# Altium schematic sheet FPGAPower.SchDoc: HPBI Controller
size B; ApprovedBy: J Johnson; CheckedBy: J Johnson; Author: sdfasdfdfAEFfasdFfaF; DrawnBy: J Johnson; Organization: Opsero Electronic Design; Address1: 21-915 Av. Marguerite-Bourgeoys; Address2: Québec (QC); Address3: G1S 3X4; DocumentNumber: OP009-001-SCH; Revision: 1.0; SheetNumber: 12; SheetTotal: 16; Tel1: (581) 308-8830; Tel2: (581) 308-8830; Project: HPBI Controller; CheckedDate: 2013-12-13; Sheet: Zynq Power Supplies; PageSetup: Record=PageOptions|CenterHorizontal=True|CenterVertical=True|PrintScale=1.08|XCorrection=1.00|YCorrection=1.00|PrintKind=0|BorderSize=5000000|LeftOffset=0|BottomOffset=0|Orientation=2|PaperLength=1000|PaperWidth=1000|Scale=100|PaperSource=7|PrintQuality=-4|MediaType=1|DitherType=10|PaperKind=Tabloid     [11 x 17 in]|PrintScaleMode=1; DrawDate: 2013-12-13; SchTitle: HPBI Controller; RevDescription: Preliminary; RevDate: 2014-01-29; RevBy: J Johnson
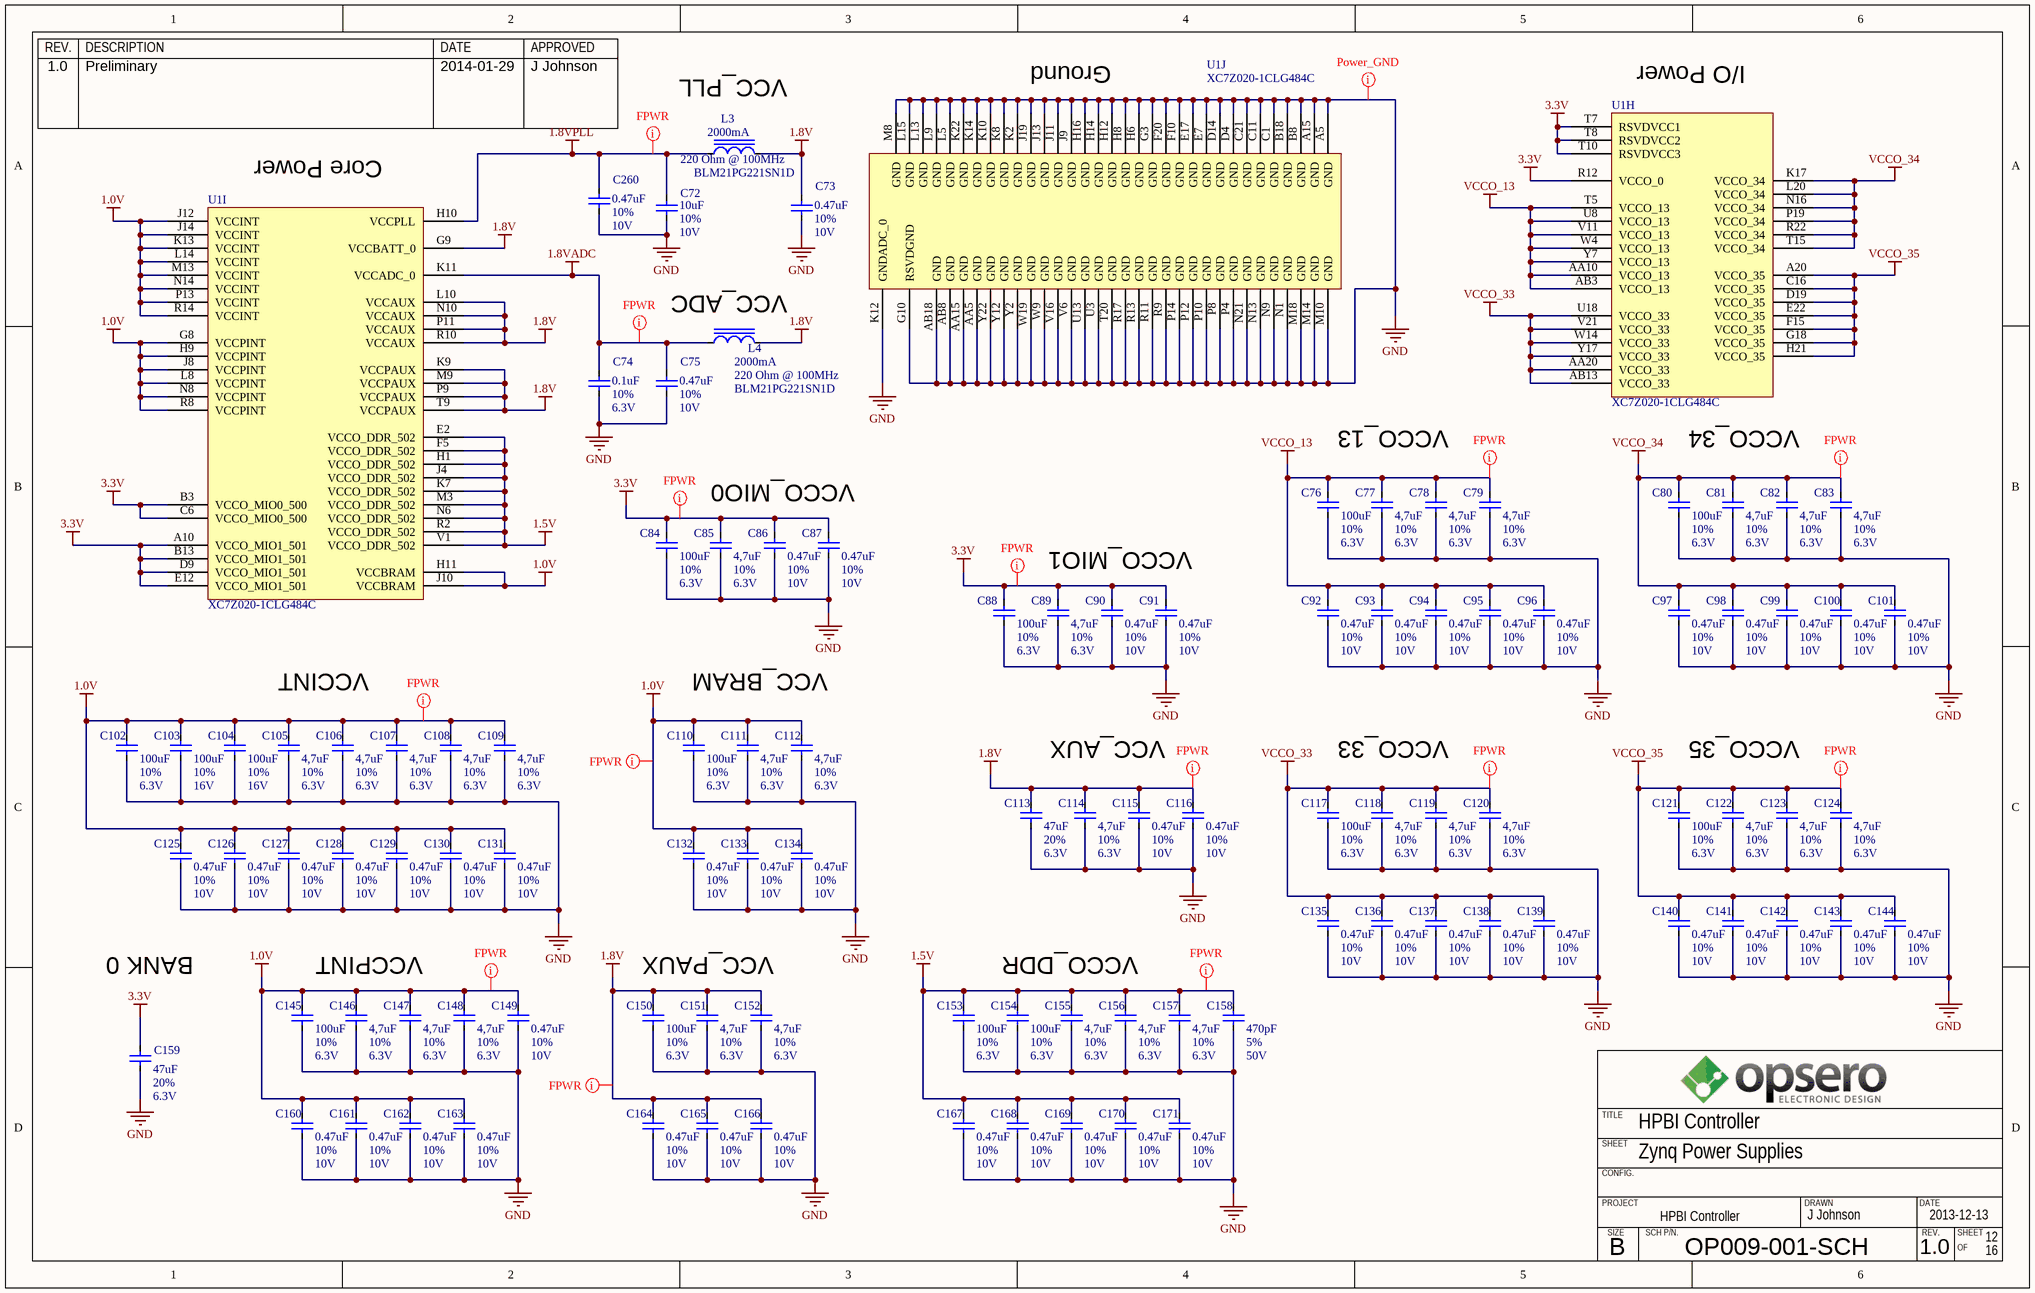
[diagram p0: FPGAPower.SchDoc]

## Parts
C72  value 10uF  Tolerance: 10%  Voltage: 10V  [CAPC1608X38N]  (hidden comment: CAPACITOR_NP_TYPE1)
C73  value 0.47uF  Tolerance: 10%  Voltage: 10V  [CAPC1005X55N]  (hidden comment: CAPACITOR_NP_TYPE1)
C74  value 0.1uF  Tolerance: 10%  Voltage: 6.3V  [CAPC0603X33N]  (hidden comment: CAPACITOR_NP_TYPE1)
C75  value 0.47uF  Tolerance: 10%  Voltage: 10V  [CAPC1005X55N]  (hidden comment: CAPACITOR_NP_TYPE1)
C76  value 100uF  Tolerance: 10%  Voltage: 6.3V  [CAPC3225X250N]  (hidden comment: CAPACITOR_NP_TYPE1)
C77  value 4,7uF  Tolerance: 10%  Voltage: 6.3V  [CAPC1005X33N]  (hidden comment: CAPACITOR_NP_TYPE1)
C78  value 4,7uF  Tolerance: 10%  Voltage: 6.3V  [CAPC1005X33N]  (hidden comment: CAPACITOR_NP_TYPE1)
C79  value 4,7uF  Tolerance: 10%  Voltage: 6.3V  [CAPC1005X33N]  (hidden comment: CAPACITOR_NP_TYPE1)
C80  value 100uF  Tolerance: 10%  Voltage: 6.3V  [CAPC3225X250N]  (hidden comment: CAPACITOR_NP_TYPE1)
C81  value 4,7uF  Tolerance: 10%  Voltage: 6.3V  [CAPC1005X33N]  (hidden comment: CAPACITOR_NP_TYPE1)
C82  value 4,7uF  Tolerance: 10%  Voltage: 6.3V  [CAPC1005X33N]  (hidden comment: CAPACITOR_NP_TYPE1)
C83  value 4,7uF  Tolerance: 10%  Voltage: 6.3V  [CAPC1005X33N]  (hidden comment: CAPACITOR_NP_TYPE1)
C84  value 100uF  Tolerance: 10%  Voltage: 6.3V  [CAPC3225X250N]  (hidden comment: CAPACITOR_NP_TYPE1)
C85  value 4,7uF  Tolerance: 10%  Voltage: 6.3V  [CAPC1005X33N]  (hidden comment: CAPACITOR_NP_TYPE1)
C86  value 0.47uF  Tolerance: 10%  Voltage: 10V  [CAPC1005X55N]  (hidden comment: CAPACITOR_NP_TYPE1)
C87  value 0.47uF  Tolerance: 10%  Voltage: 10V  [CAPC1005X55N]  (hidden comment: CAPACITOR_NP_TYPE1)
C88  value 100uF  Tolerance: 10%  Voltage: 6.3V  [CAPC3225X250N]  (hidden comment: CAPACITOR_NP_TYPE1)
C89  value 4,7uF  Tolerance: 10%  Voltage: 6.3V  [CAPC1005X33N]  (hidden comment: CAPACITOR_NP_TYPE1)
C90  value 0.47uF  Tolerance: 10%  Voltage: 10V  [CAPC1005X55N]  (hidden comment: CAPACITOR_NP_TYPE1)
C91  value 0.47uF  Tolerance: 10%  Voltage: 10V  [CAPC1005X55N]  (hidden comment: CAPACITOR_NP_TYPE1)
C92  value 0.47uF  Tolerance: 10%  Voltage: 10V  [CAPC1005X55N]  (hidden comment: CAPACITOR_NP_TYPE1)
C93  value 0.47uF  Tolerance: 10%  Voltage: 10V  [CAPC1005X55N]  (hidden comment: CAPACITOR_NP_TYPE1)
C94  value 0.47uF  Tolerance: 10%  Voltage: 10V  [CAPC1005X55N]  (hidden comment: CAPACITOR_NP_TYPE1)
C95  value 0.47uF  Tolerance: 10%  Voltage: 10V  [CAPC1005X55N]  (hidden comment: CAPACITOR_NP_TYPE1)
C96  value 0.47uF  Tolerance: 10%  Voltage: 10V  [CAPC1005X55N]  (hidden comment: CAPACITOR_NP_TYPE1)
C97  value 0.47uF  Tolerance: 10%  Voltage: 10V  [CAPC1005X55N]  (hidden comment: CAPACITOR_NP_TYPE1)
C98  value 0.47uF  Tolerance: 10%  Voltage: 10V  [CAPC1005X55N]  (hidden comment: CAPACITOR_NP_TYPE1)
C99  value 0.47uF  Tolerance: 10%  Voltage: 10V  [CAPC1005X55N]  (hidden comment: CAPACITOR_NP_TYPE1)
C100  value 0.47uF  Tolerance: 10%  Voltage: 10V  [CAPC1005X55N]  (hidden comment: CAPACITOR_NP_TYPE1)
C101  value 0.47uF  Tolerance: 10%  Voltage: 10V  [CAPC1005X55N]  (hidden comment: CAPACITOR_NP_TYPE1)
C102  value 100uF  Tolerance: 10%  Voltage: 6.3V  [CAPC3225X250N]  (hidden comment: CAPACITOR_NP_TYPE1)
C103  value 100uF  Tolerance: 10%  Voltage: 16V  [CAPC3225X250N]  (hidden comment: CAPACITOR_NP_TYPE1)
C104  value 100uF  Tolerance: 10%  Voltage: 16V  [CAPC3225X250N]  (hidden comment: CAPACITOR_NP_TYPE1)
C105  value 4,7uF  Tolerance: 10%  Voltage: 6.3V  [CAPC1005X33N]  (hidden comment: CAPACITOR_NP_TYPE1)
C106  value 4,7uF  Tolerance: 10%  Voltage: 6.3V  [CAPC1005X33N]  (hidden comment: CAPACITOR_NP_TYPE1)
C107  value 4,7uF  Tolerance: 10%  Voltage: 6.3V  [CAPC1005X33N]  (hidden comment: CAPACITOR_NP_TYPE1)
C108  value 4,7uF  Tolerance: 10%  Voltage: 6.3V  [CAPC1005X33N]  (hidden comment: CAPACITOR_NP_TYPE1)
C109  value 4,7uF  Tolerance: 10%  Voltage: 6.3V  [CAPC1005X33N]  (hidden comment: CAPACITOR_NP_TYPE1)
C110  value 100uF  Tolerance: 10%  Voltage: 6.3V  [CAPC3225X250N]  (hidden comment: CAPACITOR_NP_TYPE1)
C111  value 4,7uF  Tolerance: 10%  Voltage: 6.3V  [CAPC1005X33N]  (hidden comment: CAPACITOR_NP_TYPE1)
C112  value 4,7uF  Tolerance: 10%  Voltage: 6.3V  [CAPC1005X33N]  (hidden comment: CAPACITOR_NP_TYPE1)
C113  value 47uF  Tolerance: 20%  Voltage: 6.3V  [CAPC2013X125N]  (hidden comment: CAPACITOR_NP_TYPE1)
C114  value 4,7uF  Tolerance: 10%  Voltage: 6.3V  [CAPC1005X33N]  (hidden comment: CAPACITOR_NP_TYPE1)
C115  value 0.47uF  Tolerance: 10%  Voltage: 10V  [CAPC1005X55N]  (hidden comment: CAPACITOR_NP_TYPE1)
C116  value 0.47uF  Tolerance: 10%  Voltage: 10V  [CAPC1005X55N]  (hidden comment: CAPACITOR_NP_TYPE1)
C117  value 100uF  Tolerance: 10%  Voltage: 6.3V  [CAPC3225X250N]  (hidden comment: CAPACITOR_NP_TYPE1)
C118  value 4,7uF  Tolerance: 10%  Voltage: 6.3V  [CAPC1005X33N]  (hidden comment: CAPACITOR_NP_TYPE1)
C119  value 4,7uF  Tolerance: 10%  Voltage: 6.3V  [CAPC1005X33N]  (hidden comment: CAPACITOR_NP_TYPE1)
C120  value 4,7uF  Tolerance: 10%  Voltage: 6.3V  [CAPC1005X33N]  (hidden comment: CAPACITOR_NP_TYPE1)
C121  value 100uF  Tolerance: 10%  Voltage: 6.3V  [CAPC3225X250N]  (hidden comment: CAPACITOR_NP_TYPE1)
C122  value 4,7uF  Tolerance: 10%  Voltage: 6.3V  [CAPC1005X33N]  (hidden comment: CAPACITOR_NP_TYPE1)
C123  value 4,7uF  Tolerance: 10%  Voltage: 6.3V  [CAPC1005X33N]  (hidden comment: CAPACITOR_NP_TYPE1)
C124  value 4,7uF  Tolerance: 10%  Voltage: 6.3V  [CAPC1005X33N]  (hidden comment: CAPACITOR_NP_TYPE1)
C125  value 0.47uF  Tolerance: 10%  Voltage: 10V  [CAPC1005X55N]  (hidden comment: CAPACITOR_NP_TYPE1)
C126  value 0.47uF  Tolerance: 10%  Voltage: 10V  [CAPC1005X55N]  (hidden comment: CAPACITOR_NP_TYPE1)
C127  value 0.47uF  Tolerance: 10%  Voltage: 10V  [CAPC1005X55N]  (hidden comment: CAPACITOR_NP_TYPE1)
C128  value 0.47uF  Tolerance: 10%  Voltage: 10V  [CAPC1005X55N]  (hidden comment: CAPACITOR_NP_TYPE1)
C129  value 0.47uF  Tolerance: 10%  Voltage: 10V  [CAPC1005X55N]  (hidden comment: CAPACITOR_NP_TYPE1)
C130  value 0.47uF  Tolerance: 10%  Voltage: 10V  [CAPC1005X55N]  (hidden comment: CAPACITOR_NP_TYPE1)
C131  value 0.47uF  Tolerance: 10%  Voltage: 10V  [CAPC1005X55N]  (hidden comment: CAPACITOR_NP_TYPE1)
C132  value 0.47uF  Tolerance: 10%  Voltage: 10V  [CAPC1005X55N]  (hidden comment: CAPACITOR_NP_TYPE1)
C133  value 0.47uF  Tolerance: 10%  Voltage: 10V  [CAPC1005X55N]  (hidden comment: CAPACITOR_NP_TYPE1)
C134  value 0.47uF  Tolerance: 10%  Voltage: 10V  [CAPC1005X55N]  (hidden comment: CAPACITOR_NP_TYPE1)
C135  value 0.47uF  Tolerance: 10%  Voltage: 10V  [CAPC1005X55N]  (hidden comment: CAPACITOR_NP_TYPE1)
C136  value 0.47uF  Tolerance: 10%  Voltage: 10V  [CAPC1005X55N]  (hidden comment: CAPACITOR_NP_TYPE1)
C137  value 0.47uF  Tolerance: 10%  Voltage: 10V  [CAPC1005X55N]  (hidden comment: CAPACITOR_NP_TYPE1)
C138  value 0.47uF  Tolerance: 10%  Voltage: 10V  [CAPC1005X55N]  (hidden comment: CAPACITOR_NP_TYPE1)
C139  value 0.47uF  Tolerance: 10%  Voltage: 10V  [CAPC1005X55N]  (hidden comment: CAPACITOR_NP_TYPE1)
C140  value 0.47uF  Tolerance: 10%  Voltage: 10V  [CAPC1005X55N]  (hidden comment: CAPACITOR_NP_TYPE1)
C141  value 0.47uF  Tolerance: 10%  Voltage: 10V  [CAPC1005X55N]  (hidden comment: CAPACITOR_NP_TYPE1)
C142  value 0.47uF  Tolerance: 10%  Voltage: 10V  [CAPC1005X55N]  (hidden comment: CAPACITOR_NP_TYPE1)
C143  value 0.47uF  Tolerance: 10%  Voltage: 10V  [CAPC1005X55N]  (hidden comment: CAPACITOR_NP_TYPE1)
C144  value 0.47uF  Tolerance: 10%  Voltage: 10V  [CAPC1005X55N]  (hidden comment: CAPACITOR_NP_TYPE1)
C145  value 100uF  Tolerance: 10%  Voltage: 6.3V  [CAPC3225X250N]  (hidden comment: CAPACITOR_NP_TYPE1)
C146  value 4,7uF  Tolerance: 10%  Voltage: 6.3V  [CAPC1005X33N]  (hidden comment: CAPACITOR_NP_TYPE1)
C147  value 4,7uF  Tolerance: 10%  Voltage: 6.3V  [CAPC1005X33N]  (hidden comment: CAPACITOR_NP_TYPE1)
C148  value 4,7uF  Tolerance: 10%  Voltage: 6.3V  [CAPC1005X33N]  (hidden comment: CAPACITOR_NP_TYPE1)
C149  value 0.47uF  Tolerance: 10%  Voltage: 10V  [CAPC1005X55N]  (hidden comment: CAPACITOR_NP_TYPE1)
C150  value 100uF  Tolerance: 10%  Voltage: 6.3V  [CAPC3225X250N]  (hidden comment: CAPACITOR_NP_TYPE1)
C151  value 4,7uF  Tolerance: 10%  Voltage: 6.3V  [CAPC1005X33N]  (hidden comment: CAPACITOR_NP_TYPE1)
C152  value 4,7uF  Tolerance: 10%  Voltage: 6.3V  [CAPC1005X33N]  (hidden comment: CAPACITOR_NP_TYPE1)
C153  value 100uF  Tolerance: 10%  Voltage: 6.3V  [CAPC3225X250N]  (hidden comment: CAPACITOR_NP_TYPE1)
C154  value 100uF  Tolerance: 10%  Voltage: 6.3V  [CAPC3225X250N]  (hidden comment: CAPACITOR_NP_TYPE1)
C155  value 4,7uF  Tolerance: 10%  Voltage: 6.3V  [CAPC1005X33N]  (hidden comment: CAPACITOR_NP_TYPE1)
C156  value 4,7uF  Tolerance: 10%  Voltage: 6.3V  [CAPC1005X33N]  (hidden comment: CAPACITOR_NP_TYPE1)
C157  value 4,7uF  Tolerance: 10%  Voltage: 6.3V  [CAPC1005X33N]  (hidden comment: CAPACITOR_NP_TYPE1)
C158  value 470pF  Tolerance: 5%  Voltage: 50V  [CAPC1005X33N]  (hidden comment: CAPACITOR_NP_TYPE1)
C159  value 47uF  Tolerance: 20%  Voltage: 6.3V  [CAPC2013X125N]  (hidden comment: CAPACITOR_NP_TYPE1)
C160  value 0.47uF  Tolerance: 10%  Voltage: 10V  [CAPC1005X55N]  (hidden comment: CAPACITOR_NP_TYPE1)
C161  value 0.47uF  Tolerance: 10%  Voltage: 10V  [CAPC1005X55N]  (hidden comment: CAPACITOR_NP_TYPE1)
C162  value 0.47uF  Tolerance: 10%  Voltage: 10V  [CAPC1005X55N]  (hidden comment: CAPACITOR_NP_TYPE1)
C163  value 0.47uF  Tolerance: 10%  Voltage: 10V  [CAPC1005X55N]  (hidden comment: CAPACITOR_NP_TYPE1)
C164  value 0.47uF  Tolerance: 10%  Voltage: 10V  [CAPC1005X55N]  (hidden comment: CAPACITOR_NP_TYPE1)
C165  value 0.47uF  Tolerance: 10%  Voltage: 10V  [CAPC1005X55N]  (hidden comment: CAPACITOR_NP_TYPE1)
C166  value 0.47uF  Tolerance: 10%  Voltage: 10V  [CAPC1005X55N]  (hidden comment: CAPACITOR_NP_TYPE1)
C167  value 0.47uF  Tolerance: 10%  Voltage: 10V  [CAPC1005X55N]  (hidden comment: CAPACITOR_NP_TYPE1)
C168  value 0.47uF  Tolerance: 10%  Voltage: 10V  [CAPC1005X55N]  (hidden comment: CAPACITOR_NP_TYPE1)
C169  value 0.47uF  Tolerance: 10%  Voltage: 10V  [CAPC1005X55N]  (hidden comment: CAPACITOR_NP_TYPE1)
C170  value 0.47uF  Tolerance: 10%  Voltage: 10V  [CAPC1005X55N]  (hidden comment: CAPACITOR_NP_TYPE1)
C171  value 0.47uF  Tolerance: 10%  Voltage: 10V  [CAPC1005X55N]  (hidden comment: CAPACITOR_NP_TYPE1)
C260  value 0.47uF  Tolerance: 10%  Voltage: 10V  [CAPC1005X55N]  (hidden comment: CAPACITOR_NP_TYPE1)
L3  value 220 Ohm @ 100MHz  Current: 2000mA  Mfg Part Number 1: BLM21PG221SN1D  [INDC2012X85N]  (hidden comment: INDUCTOR_CORE_TYPE1)
L4  value 220 Ohm @ 100MHz  Current: 2000mA  Mfg Part Number 1: BLM21PG221SN1D  [INDC2012X85N]  (hidden comment: INDUCTOR_CORE_TYPE1)
U1  XC7Z020-1CLG484C  [CLG484]  (parts H,I,J of 10)

## Nets
1.0V: C102.1 C103.1 C104.1 C105.1 C106.1 C107.1 C108.1 C109.1 C110.1 C111.1 C112.1 C125.1 C126.1 C127.1 C128.1 C129.1 C130.1 C131.1 C132.1 C133.1 C134.1 C145.1 C146.1 C147.1 C148.1 C149.1 C160.1 C161.1 C162.1 C163.1 U1.G8(VCCPINT) U1.H9(VCCPINT) U1.H11(VCCBRAM) U1.J8(VCCPINT) U1.J10(VCCBRAM) U1.J12(VCCINT) U1.J14(VCCINT) U1.K13(VCCINT) U1.L8(VCCPINT) U1.L14(VCCINT) U1.M13(VCCINT) U1.N8(VCCPINT) U1.N14(VCCINT) U1.P13(VCCINT) U1.R8(VCCPINT) U1.R14(VCCINT)
1.5V: C153.1 C154.1 C155.1 C156.1 C157.1 C158.1 C167.1 C168.1 C169.1 C170.1 C171.1 U1.E2(VCCO_DDR_502) U1.F5(VCCO_DDR_502) U1.H1(VCCO_DDR_502) U1.J4(VCCO_DDR_502) U1.K7(VCCO_DDR_502) U1.M3(VCCO_DDR_502) U1.N6(VCCO_DDR_502) U1.R2(VCCO_DDR_502) U1.V1(VCCO_DDR_502)
1.8V: C73.1 C113.1 C114.1 C115.1 C116.1 C150.1 C151.1 C152.1 C164.1 C165.1 C166.1 L3.2 L4.2 U1.G9(VCCBATT_0) U1.K9(VCCPAUX) U1.L10(VCCAUX) U1.M9(VCCPAUX) U1.N10(VCCAUX) U1.P9(VCCPAUX) U1.P11(VCCAUX) U1.R10(VCCAUX) U1.T9(VCCPAUX)
1.8VADC: C74.1 C75.1 L4.1 U1.K11(VCCADC_0)
1.8VPLL: C72.1 C260.1 L3.1 U1.H10(VCCPLL)
3.3V: C84.1 C85.1 C86.1 C87.1 C88.1 C89.1 C90.1 C91.1 C159.1 U1.A10(VCCO_MIO1_501) U1.B3(VCCO_MIO0_500) U1.B13(VCCO_MIO1_501) U1.C6(VCCO_MIO0_500) U1.D9(VCCO_MIO1_501) U1.E12(VCCO_MIO1_501) U1.R12(VCCO_0) U1.T7(RSVDVCC1) U1.T8(RSVDVCC2) U1.T10(RSVDVCC3)
GND: C72.2 C73.2 C74.2 C75.2 C76.2 C77.2 C78.2 C79.2 C80.2 C81.2 C82.2 C83.2 C84.2 C85.2 C86.2 C87.2 C88.2 C89.2 C90.2 C91.2 C92.2 C93.2 C94.2 C95.2 C96.2 C97.2 C98.2 C99.2 C100.2 C101.2 C102.2 C103.2 C104.2 C105.2 C106.2 C107.2 C108.2 C109.2 C110.2 C111.2 C112.2 C113.2 C114.2 C115.2 C116.2 C117.2 C118.2 C119.2 C120.2 C121.2 C122.2 C123.2 C124.2 C125.2 C126.2 C127.2 C128.2 C129.2 C130.2 C131.2 C132.2 C133.2 C134.2 C135.2 C136.2 C137.2 C138.2 C139.2 C140.2 C141.2 C142.2 C143.2 C144.2 C145.2 C146.2 C147.2 C148.2 C149.2 C150.2 C151.2 C152.2 C153.2 C154.2 C155.2 C156.2 C157.2 C158.2 C159.2 C160.2 C161.2 C162.2 C163.2 C164.2 C165.2 C166.2 C167.2 C168.2 C169.2 C170.2 C171.2 C260.2 U1.A5(GND) U1.A15(GND) U1.AA5(GND) U1.AA15(GND) U1.AB8(GND) U1.AB18(GND) U1.B8(GND) U1.B18(GND) U1.C1(GND) U1.C11(GND) U1.C21(GND) U1.D4(GND) U1.D14(GND) U1.E7(GND) U1.E17(GND) U1.F10(GND) U1.F20(GND) U1.G3(GND) U1.G10(RSVDGND) U1.H6(GND) U1.H8(GND) U1.H12(GND) U1.H14(GND) U1.H16(GND) U1.J9(GND) U1.J11(GND) U1.J13(GND) U1.J19(GND) U1.K2(GND) U1.K8(GND) U1.K10(GND) U1.K12(GNDADC_0) U1.K14(GND) U1.K22(GND) U1.L5(GND) U1.L9(GND) U1.L13(GND) U1.L15(GND) U1.M8(GND) U1.M10(GND) U1.M14(GND) U1.M18(GND) U1.N1(GND) U1.N9(GND) U1.N13(GND) U1.N21(GND) U1.P4(GND) U1.P8(GND) U1.P10(GND) U1.P12(GND) U1.P14(GND) U1.R9(GND) U1.R11(GND) U1.R13(GND) U1.R17(GND) U1.T20(GND) U1.U3(GND) U1.U13(GND) U1.V6(GND) U1.V16(GND) U1.W9(GND) U1.W19(GND) U1.Y2(GND) U1.Y12(GND) U1.Y22(GND)
VCCO_13: C76.1 C77.1 C78.1 C79.1 C92.1 C93.1 C94.1 C95.1 C96.1 U1.AA10(VCCO_13) U1.AB3(VCCO_13) U1.T5(VCCO_13) U1.U8(VCCO_13) U1.V11(VCCO_13) U1.W4(VCCO_13) U1.Y7(VCCO_13)
VCCO_33: C117.1 C118.1 C119.1 C120.1 C135.1 C136.1 C137.1 C138.1 C139.1 U1.AA20(VCCO_33) U1.AB13(VCCO_33) U1.U18(VCCO_33) U1.V21(VCCO_33) U1.W14(VCCO_33) U1.Y17(VCCO_33)
VCCO_34: C80.1 C81.1 C82.1 C83.1 C97.1 C98.1 C99.1 C100.1 C101.1 U1.K17(VCCO_34) U1.L20(VCCO_34) U1.N16(VCCO_34) U1.P19(VCCO_34) U1.R22(VCCO_34) U1.T15(VCCO_34)
VCCO_35: C121.1 C122.1 C123.1 C124.1 C140.1 C141.1 C142.1 C143.1 C144.1 U1.A20(VCCO_35) U1.C16(VCCO_35) U1.D19(VCCO_35) U1.E22(VCCO_35) U1.F15(VCCO_35) U1.G18(VCCO_35) U1.H21(VCCO_35)

## Layout directives
net class Power_FPGA: 1.0V, 1.5V, 1.8V, 1.8VADC, 1.8VPLL, 3.3V, VCCO_13, VCCO_33, VCCO_34, VCCO_35
net class Power_GND: GND

## Notes on the sheet
- VCC_PLL
- Ground
- (near U1) I/O Power
- (near U1) Core Power
- (near L4) VCC_ADC
- VCCO_13
- VCCO_34
- VCCO_MIO0
- VCCO_MIO1
- VCCINT
- VCC_BRAM
- VCC_AUX
- VCCO_33
- VCCO_35
- BANK 0
- VCCPINT
- VCC_PAUX
- VCCO_DDR
- REV.
- DESCRIPTION
- DATE
- APPROVED
- SHEET
- TITLE
- CONFIG.
- PROJECT
- SIZE
- SCH P/N.
- DRAWN
- B
- OF

## Library data of the parts
C72 = C0603_10uF_10%_10V_X5R: Capacitor ceramic, X5R, 10uF, 10V, 10%, -55 to +85 C, EIA0603; Manufacturer 1: TDK Corporation; Mfg Part Number 1: C1608X5R1A106K080AC; EIA(I) Package: 0603; EIA(M) Package: 1608; ASSY: USED; Status: Active; Power: *; Current: *; Part Ref: C0603_10uF_10%_10V_X5R; Comment_1: *; RoHs: True; Operating Temp: -55 to +85 C
C73 C75 C86 C87 C90-C101 C115 C116 C125-C144 C149 C160-C171 C260 = C0402_0.47uF_10%_10V_X5R: Capacitor ceramic, X5R, 0.47uF, 10V, 10%, -55 to +85 C, EIA0402; Manufacturer 1: MURATA; Mfg Part Number 1: GRM155R61A474KE15D; EIA(I) Package: 0402; EIA(M) Package: 1005; ASSY: USED; Status: Active; Power: *; Current: *; Part Ref: C0402_0.47uF_10%_10V_X5R; Comment_1: *; RoHs: True; Operating Temp: -55 to +85 C; Datasheet 1: ..\datasheet\Capacitor\Murata\GRM_Serie\GRM155R61A_X5R\2012-10-27
C74 = C0201_0.1uF_10%_6.3V_X5R: Capacitor ceramic, X5R, 0.1uF, 6.3V, 10%, -55 to +125 C, EIA0201; Manufacturer 1: Murata; Mfg Part Number 1: GRM033R60J104KE19D; EIA(I) Package: 0201; EIA(M) Package: 0603; ASSY: USED; Status: Active; Power: *; Current: *; Part Ref: C0201_0.1uF_10%_6.3V_X5R; Comment_1: *; RoHs: True; Operating Temp: -55 to +85 C
C76 C80 C84 C88 C102 C110 C117 C121 C145 C150 C153 C154 = C1210_100uF_10%_6.3V_X5R: Capacitor ceramic, X5R, 100uF, 6.3V, 10%, -55 to +85 C, EIA1210; Manufacturer 1: Murata; Mfg Part Number 1: GRM32EF50J107ZE20K; EIA(I) Package: 1210; EIA(M) Package: 3225; ASSY: USED; Status: Active; Power: *; Current: *; Part Ref: C1210_100uF_10%_6.3V_X5R; Comment_1: *; RoHs: True; Operating Temp: -55 to +85 C; Datasheet 1: ..\datasheet\Capacitor\Murata\GRM_Serie\GRM32ER60J_X5R\2012-10-25
C77-C79 C81-C83 C85 C89 C105-C109 C111 C112 C114 C118-C120 C122-C124 C146-C148 C151 C152 C155-C157 = C0402_4.7uF_20%_6.3V_X7R: Capacitor ceramic, X5R, 4,7uF, 6.3V, 10%, -55 to +85 C, EIA0402; Manufacturer 1: TDK; Mfg Part Number 1: C1005X5R0J475K; EIA(I) Package: 0402; EIA(M) Package: 1005; ASSY: USED; Status: Active; Power: *; Current: *; Part Ref: C0402_4.7uF_20%_6.3V_X7R; Comment_1: *; RoHs: True; Operating Temp: -55 to +85 C; Datasheet 1: ..\datasheet\Capacitor\TDK\C Series\2012-10-25
C103 C104 = C1210_100uF_10%_16V_X5R: Capacitor ceramic, X5R, 100uF, 16V, 10%, -55 to +85 C, EIA1210; Manufacturer 1: Taiyo; Mfg Part Number 1: EMK325ABJ107MM-T; EIA(I) Package: 1210; EIA(M) Package: 3225; ASSY: USED; Status: Active; Power: *; Current: *; Part Ref: C1210_100uF_10%_16V_X5R; Comment_1: *; RoHs: True; Operating Temp: -55 to +85 C; Datasheet 1: ..\datasheet\Capacitor\Murata\GRM_Serie\GRM32ER60J_X5R\2012-10-25
C113 C159 = C0805_47uF_10%_25V_X5R: Capacitor ceramic, X5R, 47uF, 6.3V, 20%, -55 to +85 C,; Manufacturer 1: Taiyo; Mfg Part Number 1: JMK212BJ476MG-T; EIA(I) Package: 0805; EIA(M) Package: 2012; ASSY: USED; Status: Active; Power: *; Current: *; Part Ref: C0805_47uF_10%_25V_X5R; Comment_1: *; RoHs: True; Operating Temp: -55 to +85 C
C158 = C0402_470pF_5%_50V_C0G: Capacitor ceramic, C0G (NP0), 470pF, 50V, 5%, -55 to +125 C, EIA0402; Manufacturer 1: Murata; Mfg Part Number 1: GRM1555C1H471JA01D; EIA(I) Package: 0402; EIA(M) Package: 1005; ASSY: USED; Status: Active; Power: *; Current: *; Part Ref: C0402_470pF_5%_50V_C0G; Comment_1: *; RoHs: True; Operating Temp: -55 to +125 C; Datasheet 1: ..\datasheet\Capacitor\Murata\GRM_Serie\Series catalog\2013-04-30
L3 L4 = BLM21PG221SN1D: Ferrite chip, 220 Ohm @ 100MHz, 2000mA, 25%, -55 to +125 C, 0805; Manufacturer 1: Murata; EIA(I) Package: 0805; EIA(M) Package: 2012; ASSY: USED; Status: Active; Power: *; Part Ref: BLM21PG221SN1D; Voltage: *; Comment_1: *; RoHs: True; Tolerance: 25%; Operating Temp: -55 to +125 C
U1 = XC7Z020-1CLG484C: 667 MHz Zynq™-7000 AP SoC, 130 PS I/O, 200 FPGA I/O, 484-Ball BGA, Speed Grade 1, Commercial Grade; Manufacturer: Xilinx; Extensible Block RAM (# 36Kb Blocks): 560 KB (140); Flip Flops: 106400; LUTs: 53200; Speed Grade: -1; DatasheetVersion: v1.2; PackageVersion: Rev 1.1; PackageReference: CLG484; PackageDescription: Wire-Bond Chip-Scale BGA, Body 19 x 19 mm, 0.8 mm Pitch; Generic Part Number: XC7Z020; RoHS: True; Mounting Technology: Surface Mount; Code_JEDEC: MO-275-PPAA-2; PartNumber: XC7Z020-1CLG484C; ComponentLink1Description: Datasheet; ComponentLink1URL: http://www.xilinx.com/support/documentation/data_sheets/ds190-Zynq-7000-Overview.pdf; ComponentLink2Description: Package Specification; ComponentLink2URL: http://www.xilinx.com/support/documentation/user_guides/ug865-Zynq-7000-Pkg-Pinout.pdf; ComponentLink3Description: DC and AC Switching Characteristics; ComponentLink3URL: http://www.xilinx.com/support/documentation/data_sheets/ds187-XC7Z010-XC7Z020-Data-Sheet.pdf; ComponentLink4Description: Package File; ComponentLink4URL: http://www.xilinx.com/support/packagefiles/z7packages/xc7z020clg484pkg.txt; ComponentLink5Description: Packaging and Pinout; ComponentLink5URL: http://www.xilinx.com/support/documentation/user_guides/ug865-Zynq-7000-Pkg-Pinout.pdf; ComponentLink6Description: PCB and Layout Guide; ComponentLink6URL: http://www.xilinx.com/support/documentation/user_guides/ug483_7Series_PCB.pdf; Part Ref: XC7Z020-1CLG484C; Status: Active; Value: XC7Z020-1CLG484C; Manufacturer 1: Xilinx; Mfg Part Number 1: XC7Z020-1CLG484C; Package: CLG484